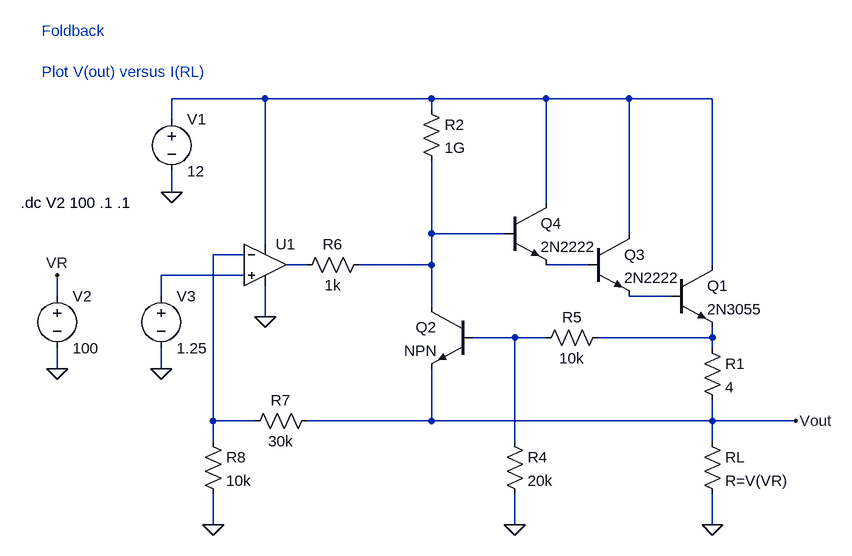
[diagram p0: schematic foldback1.asc]
foldback1.asc, the LTspice schematic file:
Version 4
SHEET 1 880 680
WIRE -144 -160 -288 -160
WIRE 112 -160 -144 -160
WIRE 288 -160 112 -160
WIRE 416 -160 288 -160
WIRE 544 -160 416 -160
WIRE 112 -144 112 -160
WIRE -288 -128 -288 -160
WIRE -288 -16 -288 -48
WIRE 288 0 288 -160
WIRE 112 48 112 -64
WIRE 224 48 112 48
WIRE 416 48 416 -160
WIRE -144 64 -144 -160
WIRE -176 80 -224 80
WIRE -80 96 -112 96
WIRE 112 96 112 48
WIRE 112 96 0 96
WIRE 352 96 288 96
WIRE 544 96 544 -160
WIRE -176 112 -304 112
WIRE -464 144 -464 112
WIRE -304 144 -304 112
WIRE 480 144 416 144
WIRE 112 160 112 96
WIRE -144 176 -144 128
WIRE 240 208 176 208
WIRE 288 208 240 208
WIRE 544 208 544 192
WIRE 544 208 368 208
WIRE 544 224 544 208
WIRE -464 256 -464 224
WIRE -304 256 -304 224
WIRE -224 336 -224 80
WIRE -160 336 -224 336
WIRE 112 336 112 256
WIRE 112 336 -80 336
WIRE 544 336 544 304
WIRE 544 336 112 336
WIRE 672 336 544 336
WIRE -224 368 -224 336
WIRE 240 368 240 208
WIRE 544 368 544 336
WIRE -224 496 -224 448
WIRE 240 496 240 448
WIRE 544 496 544 448
FLAG -288 -16 0
FLAG 544 496 0
FLAG -464 256 0
FLAG -464 112 VR
FLAG 240 496 0
FLAG 672 336 Vout
FLAG -144 176 0
FLAG -304 256 0
FLAG -224 496 0
SYMBOL npn 480 96 R0
SYMATTR InstName Q1
SYMATTR Value 2N3055
SYMBOL res 528 208 R0
SYMATTR InstName R1
SYMATTR Value 4
SYMBOL npn 176 160 M0
SYMATTR InstName Q2
SYMBOL voltage -288 -144 R0
SYMATTR InstName V1
SYMATTR Value 12
SYMBOL res 96 -160 R0
SYMATTR InstName R2
SYMATTR Value 1G
SYMBOL npn 352 48 R0
SYMATTR InstName Q3
SYMATTR Value 2N2222
SYMBOL res 528 352 R0
SYMATTR InstName RL
SYMATTR Value R=V(VR)
SYMBOL voltage -464 128 R0
SYMATTR InstName V2
SYMATTR Value 100
SYMBOL res 224 352 R0
SYMATTR InstName R4
SYMATTR Value 20k
SYMBOL res 272 224 R270
WINDOW 0 32 56 VTop 0
WINDOW 3 0 56 VBottom 0
SYMATTR InstName R5
SYMATTR Value 10k
SYMBOL Opamps\\UniversalOpamp2 -144 96 R0
SYMATTR InstName U1
SYMBOL res -96 112 R270
WINDOW 0 32 56 VTop 0
WINDOW 3 0 56 VBottom 0
SYMATTR InstName R6
SYMATTR Value 1k
SYMBOL voltage -304 128 R0
SYMATTR InstName V3
SYMATTR Value 1.25
SYMBOL res -176 352 R270
WINDOW 0 32 56 VTop 0
WINDOW 3 0 56 VBottom 0
SYMATTR InstName R7
SYMATTR Value 30k
SYMBOL res -240 352 R0
SYMATTR InstName R8
SYMATTR Value 10k
SYMBOL npn 224 0 R0
SYMATTR InstName Q4
SYMATTR Value 2N2222
TEXT -520 0 Left 0 !.dc V2 100 .1 .1
TEXT -488 -264 Left 0 ;Foldback\n \nPlot V(out) versus I(RL)

The netlist it stands for:
* foldback1.asc
Q1 N001 N007 N009 0 2N3055
R1 N009 Vout 4
Q2 N002 N008 Vout 0 NPN
V1 N001 0 12
R2 N001 N002 1G
Q3 N001 N005 N007 0 2N2222
RL Vout 0 R=V(VR)
V2 VR 0 100
R4 N008 0 20k
R5 N008 N009 10k
XU1 N006 N003 N001 0 N004 level.2 Avol=1Meg GBW=10Meg Slew=10Meg ilimit=25m rail=0 Vos=0 phimargin=45 en=0 enk=0 in=0 ink=0 Rin=500Meg  ; pins IN+ IN- V+ V- OUT
R6 N004 N002 1k
V3 N006 0 1.25
R7 N003 Vout 30k
R8 N003 0 10k
Q4 N001 N002 N005 0 2N2222
.model NPN NPN
.model PNP PNP
.lib standard.bjt
.dc V2 100 .1 .1
* Foldback
* Plot V(out) versus I(RL)
.lib UniversalOpamps2.sub
.backanno
.end